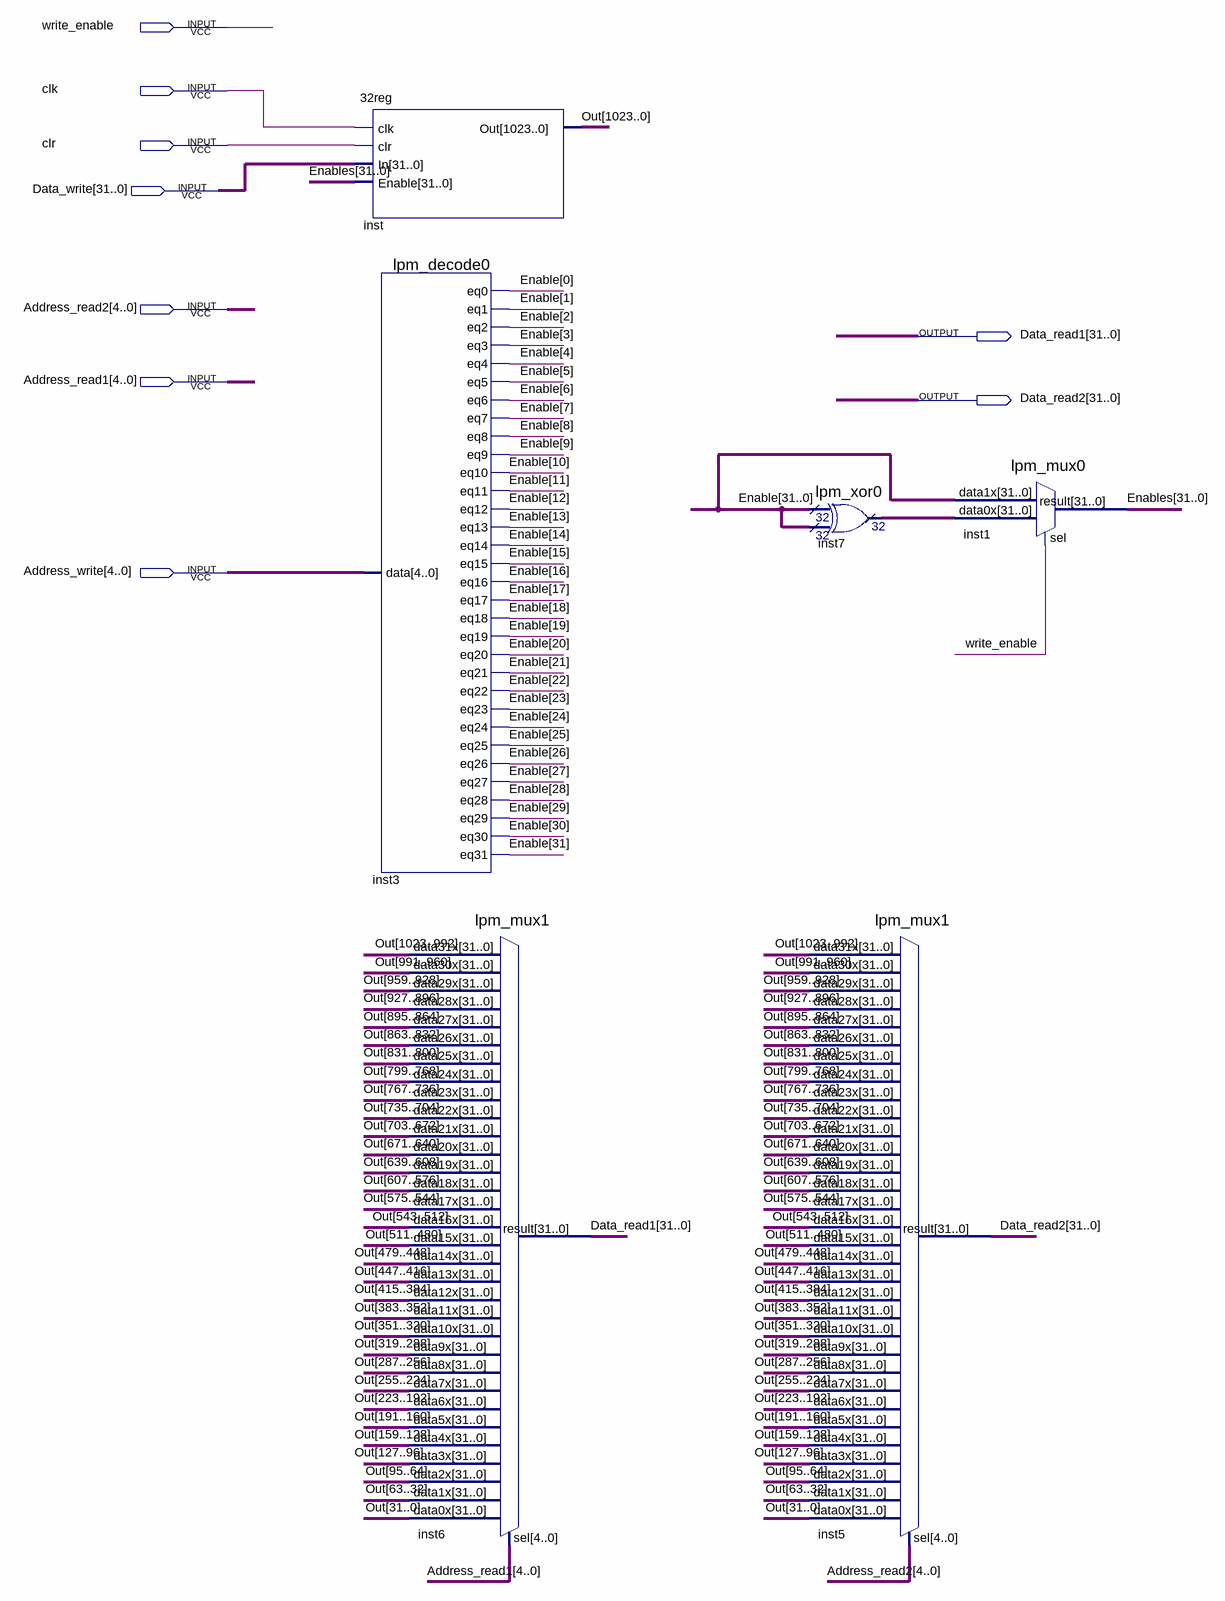
[diagram p0: schematic sheet]
// Quartus schematic RegisterFile_32word.bdf as structural Verilog: 6 symbols, 9 pins
module RegisterFile_32word (
  input  write_enable,
  input  clk,
  input  clr,
  input  [31:0] Data_write,
  input  [4:0] Address_read2,
  input  [4:0] Address_read1,
  input  [4:0] Address_write,
  output [31:0] Data_read1,
  output [31:0] Data_read2
);

  wire [31:0] Enable, Enables, inst7_result;
  wire [1023:0] Out;

  \32reg  inst (.clk(clk), .clr(clr), .In(Data_write), .Enable(Enables), .Out(Out));
  lpm_decode0 inst3 (
    .data(Address_write), .eq0(Enable[0]), .eq1(Enable[1]), .eq2(Enable[2]), .eq3(Enable[3]),
    .eq4(Enable[4]), .eq5(Enable[5]), .eq6(Enable[6]), .eq7(Enable[7]), .eq8(Enable[8]), .eq9(Enable[9]),
    .eq10(Enable[10]), .eq11(Enable[11]), .eq12(Enable[12]), .eq13(Enable[13]), .eq14(Enable[14]),
    .eq15(Enable[15]), .eq16(Enable[16]), .eq17(Enable[17]), .eq18(Enable[18]), .eq19(Enable[19]),
    .eq20(Enable[20]), .eq21(Enable[21]), .eq22(Enable[22]), .eq23(Enable[23]), .eq24(Enable[24]),
    .eq25(Enable[25]), .eq26(Enable[26]), .eq27(Enable[27]), .eq28(Enable[28]), .eq29(Enable[29]),
    .eq30(Enable[30]), .eq31(Enable[31]));
  lpm_mux1 inst6 (
    .data31x(Out[1023:992]), .data30x(Out[991:960]), .data29x(Out[959:928]), .data28x(Out[927:896]),
    .data27x(Out[895:864]), .data26x(Out[863:832]), .data25x(Out[831:800]), .data24x(Out[799:768]),
    .data23x(Out[767:736]), .data22x(Out[735:704]), .data21x(Out[703:672]), .data20x(Out[671:640]),
    .data19x(Out[639:608]), .data18x(Out[607:576]), .data17x(Out[575:544]), .data16x(Out[543:512]),
    .data15x(Out[511:480]), .data14x(Out[479:448]), .data13x(Out[447:416]), .data12x(Out[415:384]),
    .data11x(Out[383:352]), .data10x(Out[351:320]), .data9x(Out[319:288]), .data8x(Out[287:256]),
    .data7x(Out[255:224]), .data6x(Out[223:192]), .data5x(Out[191:160]), .data4x(Out[159:128]),
    .data3x(Out[127:96]), .data2x(Out[95:64]), .data1x(Out[63:32]), .data0x(Out[31:0]), .sel(Address_read1),
    .result(Data_read1));
  lpm_xor0 inst7 (.data0x(Enable), .data1x(Enable), .result(inst7_result));
  lpm_mux1 inst5 (
    .data31x(Out[1023:992]), .data30x(Out[991:960]), .data29x(Out[959:928]), .data28x(Out[927:896]),
    .data27x(Out[895:864]), .data26x(Out[863:832]), .data25x(Out[831:800]), .data24x(Out[799:768]),
    .data23x(Out[767:736]), .data22x(Out[735:704]), .data21x(Out[703:672]), .data20x(Out[671:640]),
    .data19x(Out[639:608]), .data18x(Out[607:576]), .data17x(Out[575:544]), .data16x(Out[543:512]),
    .data15x(Out[511:480]), .data14x(Out[479:448]), .data13x(Out[447:416]), .data12x(Out[415:384]),
    .data11x(Out[383:352]), .data10x(Out[351:320]), .data9x(Out[319:288]), .data8x(Out[287:256]),
    .data7x(Out[255:224]), .data6x(Out[223:192]), .data5x(Out[191:160]), .data4x(Out[159:128]),
    .data3x(Out[127:96]), .data2x(Out[95:64]), .data1x(Out[63:32]), .data0x(Out[31:0]), .sel(Address_read2),
    .result(Data_read2));
  lpm_mux0 inst1 (.data1x(Enable), .data0x(inst7_result), .sel(write_enable), .result(Enables));
endmodule
